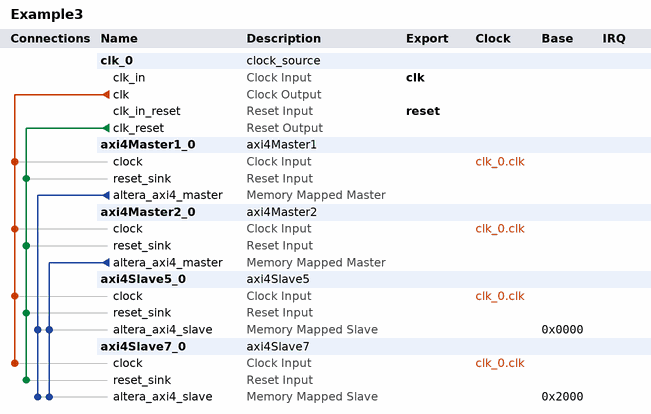
[diagram p0: system contents]
# Platform Designer (Qsys) system Example3, Cyclone V 5CGXFC7C7F23C8
# Parameters at their usual value, and those the tool derives, are not listed.
package require -exact qsys 21.1
create_system Example3
set_project_property DEVICE_FAMILY {Cyclone V}
set_project_property DEVICE 5CGXFC7C7F23C8

add_instance clk_0 clock_source 21.1
set_instance_parameter_value clk_0 clockFrequency 50000000

add_instance axi4Master1_0 axi4Master1 1.0

add_instance axi4Master2_0 axi4Master2 1.0

add_instance axi4Slave5_0 axi4Slave5 1.0

add_instance axi4Slave7_0 axi4Slave7 1.0

# connections
add_connection clk_0.clk axi4Master1_0.clock clock
add_connection clk_0.clk axi4Master2_0.clock clock
add_connection clk_0.clk axi4Slave5_0.clock clock
add_connection clk_0.clk axi4Slave7_0.clock clock
add_connection clk_0.clk_reset axi4Master1_0.reset_sink reset
add_connection clk_0.clk_reset axi4Master2_0.reset_sink reset
add_connection clk_0.clk_reset axi4Slave5_0.reset_sink reset
add_connection clk_0.clk_reset axi4Slave7_0.reset_sink reset
add_connection axi4Master1_0.altera_axi4_master axi4Slave5_0.altera_axi4_slave avalon
set_connection_parameter_value axi4Master1_0.altera_axi4_master/axi4Slave5_0.altera_axi4_slave baseAddress 0x0000
add_connection axi4Master1_0.altera_axi4_master axi4Slave7_0.altera_axi4_slave avalon
set_connection_parameter_value axi4Master1_0.altera_axi4_master/axi4Slave7_0.altera_axi4_slave baseAddress 0x2000
add_connection axi4Master2_0.altera_axi4_master axi4Slave5_0.altera_axi4_slave avalon
set_connection_parameter_value axi4Master2_0.altera_axi4_master/axi4Slave5_0.altera_axi4_slave baseAddress 0x0000
add_connection axi4Master2_0.altera_axi4_master axi4Slave7_0.altera_axi4_slave avalon
set_connection_parameter_value axi4Master2_0.altera_axi4_master/axi4Slave7_0.altera_axi4_slave baseAddress 0x2000

# exported interfaces
add_interface clk clock sink
set_interface_property clk EXPORT_OF clk_0.clk_in
add_interface reset reset sink
set_interface_property reset EXPORT_OF clk_0.clk_in_reset

set_interconnect_requirement {$system} qsys_mm.clockCrossingAdapter HANDSHAKE
set_interconnect_requirement {$system} qsys_mm.enableEccProtection FALSE
set_interconnect_requirement {$system} qsys_mm.insertDefaultSlave FALSE
set_interconnect_requirement {$system} qsys_mm.maxAdditionalLatency 1

save_system Example3.qsys
